# EAGLE design bga_test (EAGLE 6.4)
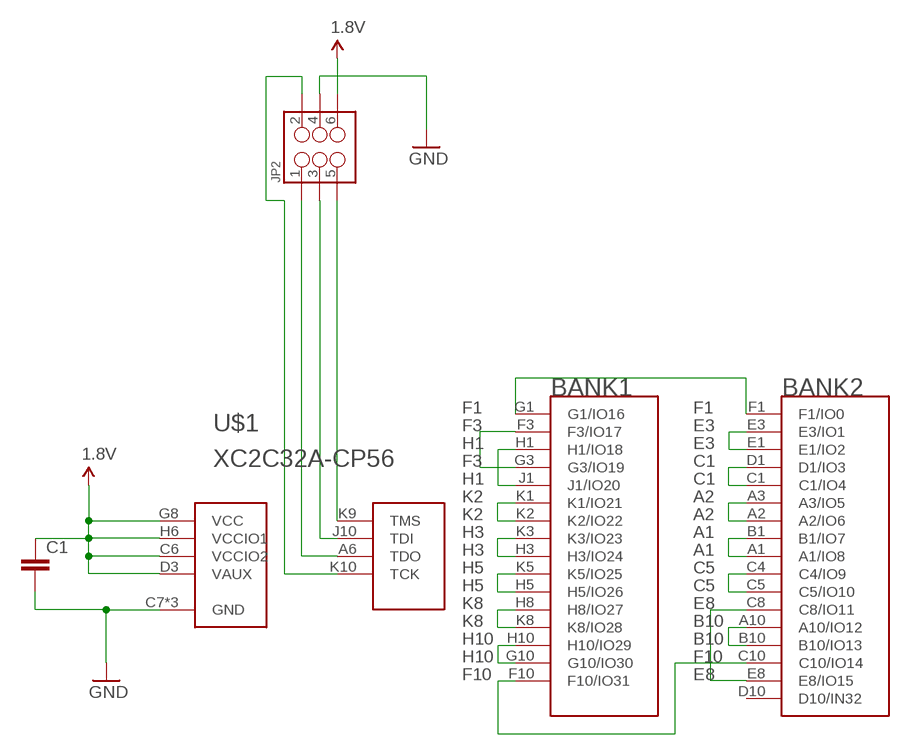
[diagram p0: schematic, sheet 1]

## Parts
C1  CAP0402-CAP  [0402-CAP]
JP2  M03X2NO_SILK  [2X3-NS]
U$1  XC2C32A-CP56  [XILINX_CP56]

## Nets
1.8V: C1.1 JP2.6 U$1.C6(VCCIO2) U$1.D3(VAUX) U$1.G8(VCC) U$1.H6(VCCIO1)
A1: U$1.A1(A1/IO8) U$1.B1(B1/IO7)
A2: U$1.A2(A2/IO6) U$1.A3(A3/IO5)
B10: U$1.A10(A10/IO12) U$1.B10(B10/IO13)
C1: U$1.C1(C1/IO4) U$1.D1(D1/IO3)
C5: U$1.C4(C4/IO9) U$1.C5(C5/IO10)
E3: U$1.E1(E1/IO2) U$1.E3(E3/IO1)
E8: U$1.C8(C8/IO11) U$1.E8(E8/IO15)
F1: U$1.F1(F1/IO0) U$1.G1(G1/IO16)
F3: U$1.F3(F3/IO17) U$1.G3(G3/IO19)
F10: U$1.C10(C10/IO14) U$1.F10(F10/IO31)
GND: C1.2 JP2.4 U$1.C7(GND) U$1.F8(GND) U$1.H4(GND)
H1: U$1.H1(H1/IO18) U$1.J1(J1/IO20)
H3: U$1.H3(H3/IO24) U$1.K3(K3/IO23)
H5: U$1.H5(H5/IO26) U$1.K5(K5/IO25)
H10: U$1.G10(G10/IO30) U$1.H10(H10/IO29)
K2: U$1.K1(K1/IO21) U$1.K2(K2/IO22)
K8: U$1.H8(H8/IO27) U$1.K8(K8/IO28)
TCK: JP2.2 U$1.K10(TCK)
TDI: JP2.3 U$1.J10(TDI)
TDO: JP2.1 U$1.A6(TDO)
TMS: JP2.5 U$1.K9(TMS)
Unconnected: U$1.A4(NC) U$1.A5(NC) U$1.A7(NC) U$1.A8(NC) U$1.A9(NC) U$1.C3(NC) U$1.D8(NC) U$1.D10(D10/IN32) U$1.E10(NC) U$1.H7(NC) U$1.K4(NC) U$1.K6(NC) U$1.K7(NC)

## Library data of the parts
C1 = SparkFun-Capacitors:CAP: Capacitor Standard 0603 ceramic capacitor, and 0.1" leaded capacitor.
JP2 = SparkFun-Connectors:M03X2: 2x3 .1" header. Shrouded, with keying- CONN-10681 SMT- CONN-11415 Pogo pins- HW-11044
U$1 = kmod:XC2C32A-CP56

## Board
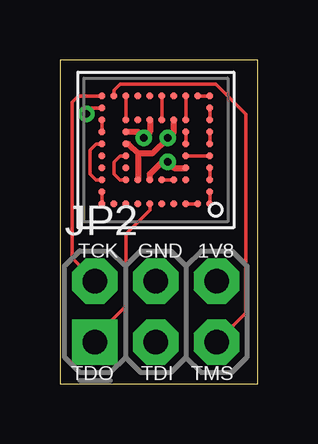
[diagram p1: board, top side]
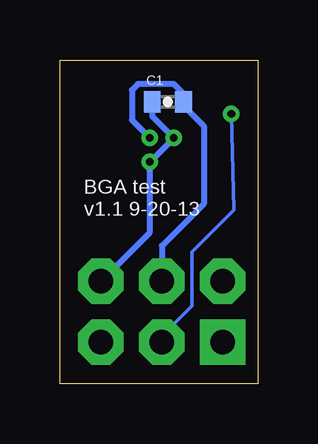
[diagram p2: board, bottom side, seen from below]

Size 8.25 x 13.5 mm. Coordinates in mm from the lower left corner, seen from the top.
Outline: 0,0 8.25,0 8.25,13.5 0,13.5 0,0
Copper layers (1*16): Top 0.0356mm / dielectric 1.5011mm / Bottom 0.0356mm
Design rules "OSHPark_mine": minimum track width 6mil, minimum drill 13mil, track to track 6mil, track to pad 6mil, pad to pad 6mil, via to via 6mil, smd to smd 6mil, copper to edge 15mil, drill to drill 6mil, minimum pad ring 7mil, minimum via ring 7mil, stop-mask expansion 2mil, vias tented up to drill 13mil, thermal gap 10mil

### Footprints (pad centres in the part's own frame; a part is rotated, then mirrored left to right if it is on the bottom)
0402-CAP = smd 0.7 x 0.9: 1 -0.65,0; 2 0.65,0
2X3-NS = drill 1.016 pad 1.88 square: 1 -2.54,-1.27 | drill 1.016 pad 1.88 octagon: 2 -2.54,1.27; 3 0,-1.27; 4 0,1.27; 5 2.54,-1.27; 6 2.54,1.27
XILINX_CP56 = smd 0.27 x 0.27: A1 2.25,-2.25; A2 1.75,-2.25; A3 1.25,-2.25; A4 0.75,-2.25; A5 0.25,-2.25; A6 -0.25,-2.25; A7 -0.75,-2.25; A8 -1.25,-2.25; A9 -1.75,-2.25; A10 -2.25,-2.25; B1 2.25,-1.75; B10 -2.25,-1.75; C1 2.25,-1.25; C3 1.25,-1.25; C4 0.75,-1.25; C5 0.25,-1.25; C6 -0.25,-1.25; C7 -0.75,-1.25; C8 -1.25,-1.25; C10 -2.25,-1.25; D1 2.25,-0.75; D3 1.25,-0.75; D8 -1.25,-0.75; D10 -2.25,-0.75; E1 2.25,-0.25; E3 1.25,-0.25; E8 -1.25,-0.25; E10 -2.25,-0.25; F1 2.25,0.25; F3 1.25,0.25; F8 -1.25,0.25; F10 -2.25,0.25; G1 2.25,0.75; G3 1.25,0.75; G8 -1.25,0.75; G10 -2.25,0.75; H1 2.25,1.25; H3 1.25,1.25; H4 0.75,1.25; H5 0.25,1.25; H6 -0.25,1.25; H7 -0.75,1.25; H8 -1.25,1.25; H10 -2.25,1.25; J1 2.25,1.75; J10 -2.25,1.75; K1 2.25,2.25; K2 1.75,2.25; K3 1.25,2.25; K4 0.75,2.25; K5 0.25,2.25; K6 -0.25,2.25; K7 -0.75,2.25; K8 -1.25,2.25; K9 -1.75,2.25; K10 -2.25,2.25

### Placement (x,y rotation side)
C1  3.75,11.75 0 bottom
JP2  4,3 0 top
U$1  4,9.75 0 top

### Tracks (layer width: path | path; a pad name or v marks a point on that pad's centre or on a via)
1.8V  (via drill 0.33)
  Top 0.254: U$1.H6 3.75,10.5 v3.5,10.25 3.25,10.5 U$1.G8 | U$1.C6 3.75,8.75 4.25,9.25 v4.5,9.25 4.75,9 U$1.D3
  Bottom 0.254: C1.1 4.4,11.15 v3.5,10.25 v4.5,9.25 4.5,6.31 JP2.6
A1
  Top 0.152: U$1.B1 U$1.A1
A2
  Top 0.152: U$1.A2 U$1.A3
B10
  Top 0.152: U$1.B10 U$1.A10
C1
  Top 0.152: U$1.D1 U$1.C1
C5
  Top 0.152: U$1.C4 U$1.C5
E3
  Top 0.152: U$1.E1 U$1.E3
E8
  Top 0.152: U$1.E8 2.5,9.5 2.25,9.25 2.25,8.75 2.5,8.5 U$1.C8
F1
  Top 0.152: U$1.G1 U$1.F1
F3
  Top 0.152: U$1.G3 U$1.F3
F10
  Top 0.152: U$1.C10 1.5,8.5 1.25,8.75 1.25,9.75 1.5,10 U$1.F10
GND  (via drill 0.33)
  Top 0.254: U$1.H4 4.75,10.5 v4.5,10.25 3.85,9.6 3.25,9.6 | U$1.F8 2.85,10 3.25,9.6 | 3.25,9.6 U$1.C7
  Bottom 0.152: 3.1,12.1 C1.2 3.1,11.6
  Bottom 0.254: 3.1,12.1 3.5,12.5 5,12.5 5.25,12.25 5.25,11 v4.5,10.25 | 3.1,11.6 2.25,10.75 2.25,7.5 4,5.75 JP2.4
H1
  Top 0.152: U$1.J1 U$1.H1
H3
  Top 0.152: U$1.K3 U$1.H3
H5
  Top 0.152: U$1.K5 U$1.H5
H10
  Top 0.152: U$1.G10 U$1.H10
K2
  Top 0.152: U$1.K1 U$1.K2
K8
  Top 0.152: U$1.K8 U$1.H8
TCK
  Top 0.152: U$1.K10 0.75,12 0.5,11.75 0.5,5.23 JP2.2
TDI  (via drill 0.33)
  Top 0.152: v1.1,11.25 1.25,11.5 U$1.J10
  Bottom 0.152: JP2.3 4,2 2.75,3.25 2.75,5.5 1,7.25 v1.1,11.25
TDO
  Top 0.152: JP2.1 1.46,1.96 2.75,3.25 2.75,6.25 3.75,7.25 U$1.A6
TMS
  Top 0.152: JP2.5 7.75,2.94 7.75,11.25 6.5,12.5 2.5,12.5 2.25,12.25 U$1.K9

### Text on the board
tPlace: TCK | GND | 1V8 | TDO | TDI | TMS
bPlace: BGA test / v1.1 9-20-13